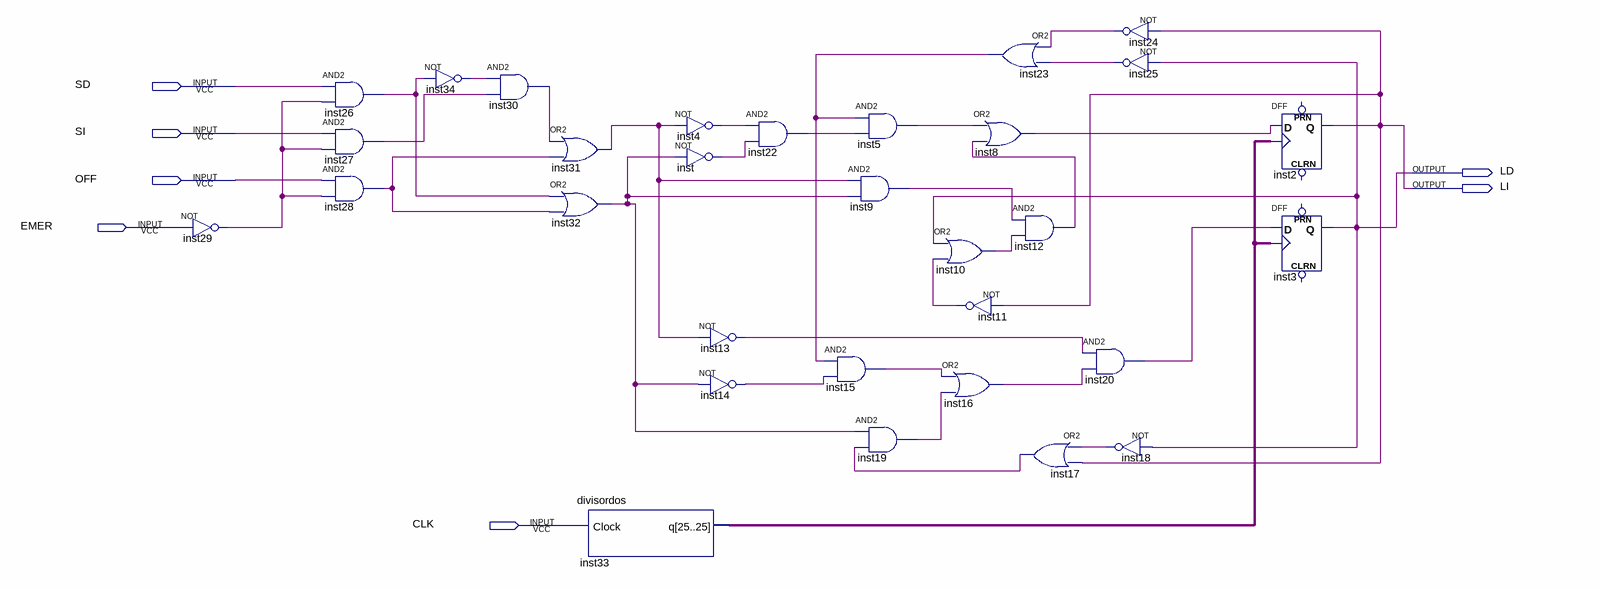
[diagram p0: schematic sheet]
// Quartus schematic Luces_Exp1.bdf as structural Verilog: 31 symbols, 7 pins
module Luces_Exp1 (
  input  SD,
  input  SI,
  input  OFF,
  input  EMER,
  input  CLK,
  output LD,
  output LI
);

  wire inst4_out, inst5_out, inst8_out, inst9_out, inst10_out, inst11_out, inst12_out, inst13_out,
       inst14_out, inst15_out, inst16_out, inst17_out, inst18_out, inst19_out, inst20_out, inst22_out,
       inst23_out, inst24_out, inst25_out, inst26_out, inst27_out, inst28_out, inst29_out, inst30_out,
       inst31_out, inst32_out, inst33_q, inst34_out, inst_out;

  not inst29 (inst29_out, EMER);
  and inst26 (inst26_out, SD, inst29_out);
  and inst27 (inst27_out, SI, inst29_out);
  and inst28 (inst28_out, OFF, inst29_out);
  not inst34 (inst34_out, inst26_out);
  and inst30 (inst30_out, inst34_out, inst27_out);
  or inst31 (inst31_out, inst30_out, inst28_out);
  or inst32 (inst32_out, inst26_out, inst28_out);
  divisordos inst33 (.Clock(CLK), .q(inst33_q));
  not inst4 (inst4_out, inst31_out);
  not inst (inst_out, inst32_out);
  not inst13 (inst13_out, inst31_out);
  not inst14 (inst14_out, inst32_out);
  and inst22 (inst22_out, inst4_out, inst_out);
  and inst15 (inst15_out, inst23_out, inst14_out);
  and inst5 (inst5_out, inst23_out, inst22_out);
  and inst9 (inst9_out, inst31_out, inst32_out);
  and inst19 (inst19_out, inst32_out, inst17_out);
  or inst10 (inst10_out, LD, inst11_out);
  not inst11 (inst11_out, LI);
  or inst16 (inst16_out, inst15_out, inst19_out);
  or inst23 (inst23_out, inst24_out, inst25_out);
  or inst8 (inst8_out, inst5_out, inst12_out);
  and inst12 (inst12_out, inst9_out, inst10_out);
  or inst17 (inst17_out, inst18_out, LI);
  and inst20 (inst20_out, inst13_out, inst16_out);
  not inst24 (inst24_out, LI);
  not inst25 (inst25_out, LD);
  not inst18 (inst18_out, LD);
  DFF inst2 (.CLK(inst33_q), .D(inst8_out), .Q(LI));  // open: CLRN, PRN
  DFF inst3 (.CLK(inst33_q), .D(inst20_out), .Q(LD));  // open: CLRN, PRN
endmodule
